# Altium schematic sheet Sheet1.SchDoc
size A; SheetNumber: 1; SheetTotal: 1; SPICEModelCacheVKHHSDNT: <root> / <DocumentId>VKHHSDNT</DocumentId> / <CacheFrame Number="0"> / <Model Name="dpsw8" Kind="CKT"> / <Text>* DIP switch 8 / * jjt 20/6/2002: created / * / *             Switch connections: / *             sw1 / *             |  |  sw2 / *             |  |  |  |  sw3 / *             |  |  |  |  |  |   sw4 / *             |  |  |  |  |  |  |   |    sw5 / *             |  |  |  |  |  |  |   |   |   |    sw6 / *             |  |  |  |  |  |  |   |   |   |   |   |    sw7 / *             |  |  |  |  |  |  |   |   |   |   |   |   |   |    sw8 / *             |  |  |  |  |  |  |   |   |   |   |   |   |   |   |   | / *             |  |  |  |  |  |  |   |   |   |   |   |   |   |   |   | / .subckt dpsw8 1  2  4  5  7  8  10  11  13  14  16  17  19  20  22  23 / + PARAMS: STATE1=0 STATE2=0 STATE3=0 STATE4=0 STATE5=0 STATE6=0 STATE7=0 STATE8=0 RON=1m ROFF=100E6 / * / V1 3  0 {STATE1} / V2 6  0 {STATE2} / V3 9  0 {STATE3} / V4 12 0 {STATE4} / V5 15 0 {STATE5} / V6 18 0 {STATE6} / V7 21 0 {STATE7} / V8 24 0 {STATE8} / * / SDIP1 1  2  3  0 DIPMOD / SDIP2 4  5  6  0 DIPMOD / SDIP3 7  8  9  0 DIPMOD / SDIP4 10 11 12 0 DIPMOD / SDIP5 13 14 15 0 DIPMOD / SDIP6 16 17 18 0 DIPMOD / SDIP7 19 20 21 0 DIPMOD / SDIP8 22 23 24 0 DIPMOD / * / .MODEL DIPMOD SW(VT=0.5 RON={RON} ROFF={ROFF}) / .ends dpsw8</Text> / </Model> / </CacheFrame> / </root>
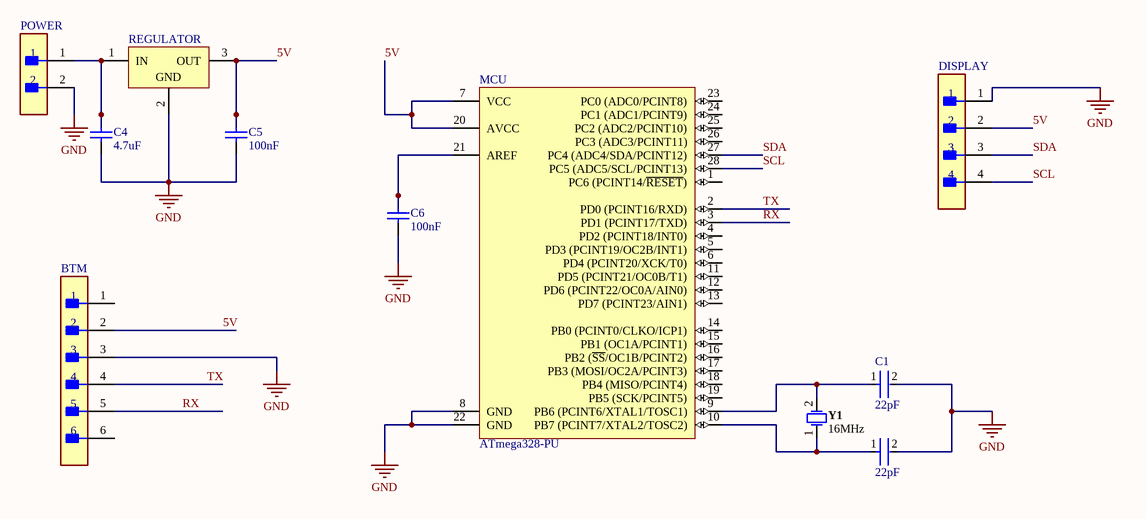
[diagram p0: Sheet1.SchDoc]

## Parts
BTM  22-27-2061  [FP-22-27-2061-MFG]  (value not drawn)
C1  22pF  [FP-RCE0K1-MFG]
C2  22pF  [FP-RCE0K1-MFG]
C4  4.7uF  [AVX-MD01]
C5  100nF  [AVX-MD01]
C6  100nF  [AVX-MD01]
DISPLAY  LCD DISPLAY  [FP-47053-3000-MFG]  (value not drawn)
MCU  ATmega328-PU  [28P3]
POWER  TSW-102-07-L-S  [FP-TSW-102-07-L-S-MFG]  (value not drawn)
REGULATOR  L7805CV  [TO220]  (value not drawn)
Y1  16MHz  [FOX-FOXSLF160-20]

## Nets
GND: BTM.3 C1.2 C2.2 C4.1 C5.1 C6.1 DISPLAY.1 MCU.8(GND) MCU.22(GND) POWER.2 REGULATOR.2(GND)
5V: BTM.2 C5.2 DISPLAY.2 MCU.7(VCC) MCU.20(AVCC) REGULATOR.3(OUT)
RX: BTM.5 MCU.3(PD1_(PCINT17/TXD))
SCL: DISPLAY.4 MCU.28(PC5_(ADC5/SCL/PCINT13))
SDA: DISPLAY.3 MCU.27(PC4_(ADC4/SDA/PCINT12))
TX: BTM.4 MCU.2(PD0_(PCINT16/RXD))
NetC1_1: C1.1 MCU.9(PB6_(PCINT6/XTAL1/TOSC1)) Y1.2
NetC2_1: C2.1 MCU.10(PB7_(PCINT7/XTAL2/TOSC2)) Y1.1
NetC4_2: C4.2 POWER.1 REGULATOR.1(IN)
NetC6_2: C6.2 MCU.21(AREF)

Not connected (* = marked no-connect by the designer): BTM 1 6; MCU 1(PC6_(PCINT14/~{RESET})) 4(PD2_(PCINT18/INT0)) 5(PD3_(PCINT19/OC2B/INT1)) 6(PD4_(PCINT20/XCK/T0)) 11(PD5_(PCINT21/OC0B/T1)) 12(PD6_(PCINT22/OC0A/AIN0)) 13(PD7_(PCINT23/AIN1)) 14(PB0_(PCINT0/CLKO/ICP1)) 15(PB1_(OC1A/PCINT1)) 16(PB2_(~{SS}/OC1B/PCINT2)) 17(PB3_(MOSI/OC2A/PCINT3)) 18(PB4_(MISO/PCINT4)) 19(PB5_(SCK/PCINT5)) 23(PC0_(ADC0/PCINT8)) 24(PC1_(ADC1/PCINT9)) 25(PC2_(ADC2/PCINT10)) 26(PC3_(ADC3/PCINT11))

## Library data of the parts
BTM = CMP-04776-000309-1: CONN HEADER VERT 6POS 2.54MM; Number of Contacts: 6; Current Rating: 4A; Voltage Rating (AC): 250V; Contact Resistance: 10mR; Hole Diameter: 1.02mm; Connector Type: Male Pin; Gender: Male; Mount: Through Hole; REACH SVHC: No SVHC; Number of Rows: 1; Contact Plating: Tin; Series: KK; Depth: 5.8mm; Flammability Rating: UL94 V-0; Contact Type: Male Pin; Lead Pitch: 2.54mm; Min Operating Temperature: 0°C; Pitch: 2.54mm; Radiation Hardening: No; Color: Natural; Length: 15.24mm; Termination: Solder; Orientation: Straight; Contact Material: Brass; Max Voltage Rating (AC): 250V; Housing Material: Nylon; Max Operating Temperature: 75°C; Working Voltage: 250V; Max Current Rating: 4A; Fastening Type: Friction; Voltage Rating: 250V; Housing Color: White; Packaging: Bulk; Material: Nylon; Contact Mating Length: 0.295inch; Package Quantity: 10000; Number of Positions: 6
C1 C2 = CMP-06035-004895-1: Cap Ceramic 22pF 50V C0G ±5% Radial 5mm +125°C Automotive Bulk; Lead/Base Style: Formed Leads; Lead Diameter: 0.5mm; Max Operating Temperature: 125°C; Termination: Radial; Package Quantity: 2000; Capacitance: 22pF; Dielectric: C0G; Height - Seated (Max): 0.138inch; Width: 0.098inch; Lead Pitch: 0.197inch; Tolerance: 5%; Resistor Type: Ceramic; Case/Package: Radial; Mount: Through Hole; Voltage Rating: 50V; Ratings: AEC-Q200; Min Operating Temperature: -55°C; Packaging: Tape and Reel; Voltage Rating (DC): 50V; Height: 3.5mm; Length: 0.142inch
C4 = CMP-2000-06690-1: Ceramic Capacitor, 0.1 uF, +/- 20%, 50 V, -55 to 125 degC, 2-Pin THD (MD01), Bulk; Manufacturer: AVX; Dielectric: Z5U; Rated Voltage: 50V; Capacitance: 100nF; Mounting Technology: ThroughHole; Case Size/Dimension: 6.6x3.43x2.54mm; Package Reference: AVX-MD01; Datasheet URL: http://datasheets.avx.com/dipguard.pdf; Package Description: 2-Pin Through Hole Device, Body 6.6 x 2.54 mm; Datasheet Version: 08/2015; Tolerance (%): ±20%; Manufacturer URL: http://www.avx.com/
C5 C6 = CMP-2000-06690-1: Ceramic Capacitor, 0.1 uF, +/- 20%, 50 V, -55 to 125 degC, 2-Pin THD (MD01), Bulk; Manufacturer: AVX; Dielectric: Z5U; Rated Voltage: 50V; Mounting Technology: ThroughHole; Case Size/Dimension: 6.6x3.43x2.54mm; Package Reference: AVX-MD01; Datasheet URL: http://datasheets.avx.com/dipguard.pdf; Package Description: 2-Pin Through Hole Device, Body 6.6 x 2.54 mm; Datasheet Version: 08/2015; Tolerance (%): ±20%; Manufacturer URL: http://www.avx.com/; Capacitance: 100nF
DISPLAY = CMP-04776-000447-1: CONN HEADER VERT 4POS 2.54MM; Glow Wire Compliant: Non-compliant; Voltage Rating: 250V; Current Rating: 4A; Number of Circuits: 4; Gender: Male; Orientation: Straight; Packaging: Bulk; Series: 47053; RoHS Compliant: Yes; Termination: Through Hole; Contact Plating: Tin; Mount: Through Hole; Number of Rows: 1; Pitch: 2.54mm; Halogen Free: Low Halogen; Number of Contacts: 4; Min Operating Temperature: 0°C; Package Quantity: 12000; Contact Material: Copper Alloy; Max Operating Temperature: 75°C; REACH SVHC: No SVHC; Number of Positions: 4
MCU = CMP-0095-00015-2: 8-bit AVR Microcontroller, 32KB Flash, 1KB EEPROM, 2KB SRAM, 28-pin PDIP, Industrial Grade (-40°C to 85°C); ComponentLink3Description: ATmega48A/48PA/88A/88PA/168A/168PA/328/328P Summary; RevisionNote: DatasheetVersion updated. URLs added.; DatasheetVersion: revD, May-2011; ComponentLink1URL: http://www.atmel.com/; PackageVersion: revB, Sep-2001; PackageDescription: 28-lead (0.300"/7.62mm Wide) Plastic Dual Inline Package (PDIP); PackageReference: 28P3; ComponentLink1Description: Manufacturer URL; ComponentLink2Description: ATmega48A/48PA/88A/88PA/168A/168PA/328/328P Datasheet; ComponentLink3URL: http://www.atmel.com/dyn/resources/prod_documents/8271S.pdf; ComponentLink2URL: http://www.atmel.com/dyn/resources/prod_documents/8271.pdf
POWER = CMP-02766-001428-1: CONN HEADER VERT 2POS 2.54MM; Voltage Rating: 550V; Current Rating: 7.6A; Gender: Male; Number of Contacts: 2; Connector Type: Male Pin; Radiation Hardening: No; Orientation: Straight; Contact Plating: Gold; Max Operating Temperature: 125°C; Mount: Through Hole; Package Quantity: 1; Number of Rows: 1; Housing Material: Polyester; RoHS Compliant: Yes; Length: 5.08mm; Max Voltage Rating (AC): 550V; Pitch: 2.54mm; Packaging: Bulk; Depth: 2.54mm; Termination: Solder; Min Operating Temperature: -55°C; Housing Color: Black; Lead Free: Lead Free; Color: Black; Number of Positions: 2; Width: 2.54mm; Max Current Rating: 7.6A; REACH SVHC: No SVHC; Contact Material: Bronze; Contact Mating Length: 0.23inch; Series: TSW; Contact Type: Male Pin
REGULATOR = CMP-0244-00483-1: Positive Voltage Regulator, 5V, 3-Pin TO-220; PackageDescription: TO, Thru-Hole, Vertical, Heatsink Mounted; 3 In-Line Leads; Pitch 2.54 mm; ComponentLink2Description: Datasheet; PackageReference: TO220; ComponentLink3URL: http://www.st.com/internet/com/TECHNICAL_RESOURCES/TECHNICAL_LITERATURE/PACKAGE_INFORMATION/CD00004649.pdf; DatasheetVersion: 16/11/2011; ComponentLink1Description: Manufacturer URL; ComponentLink1URL: http://www.st.com; PackageVersion: ver3.0; ComponentLink3Description: Package Specification; ComponentLink2URL: http://www.st.com/internet/com/TECHNICAL_RESOURCES/TECHNICAL_LITERATURE/DATASHEET/CD00000444.pdf
Y1 = CMP-1749-00003-1: Resistance Weld Thru-Hole Crystal, 16 MHz, -20 to 70 degC, 2-Pin THD, RoHS, Bulk; Voltage Rating: 250 V; Tolerance: 1%; Resistance: 221 kohm; Case\Package: Axial; Power Rating: 250 mW; RoHSCompliant: true; Package Quantity: 200; Packaging: Bulk; Min Operating Temperature: -55 degC; DatasheetVersion: Mar-15; ComponentLink1URL: http://www.foxonline.com/; Max Operating Temperature: 155 degC; PackageReference: FOXSLF160-20; Mount: Through Hole; PackageDescription: 2-Pin Through Hole Device, Body 11.35 x 4.65 mm; ComponentLink1Description: Manufacturer URL; ComponentLink2URL: http://www.foxonline.com/pdfs/hc49slf.pdf; ComponentLink2Description: Datasheet; Length: 0.248 inch